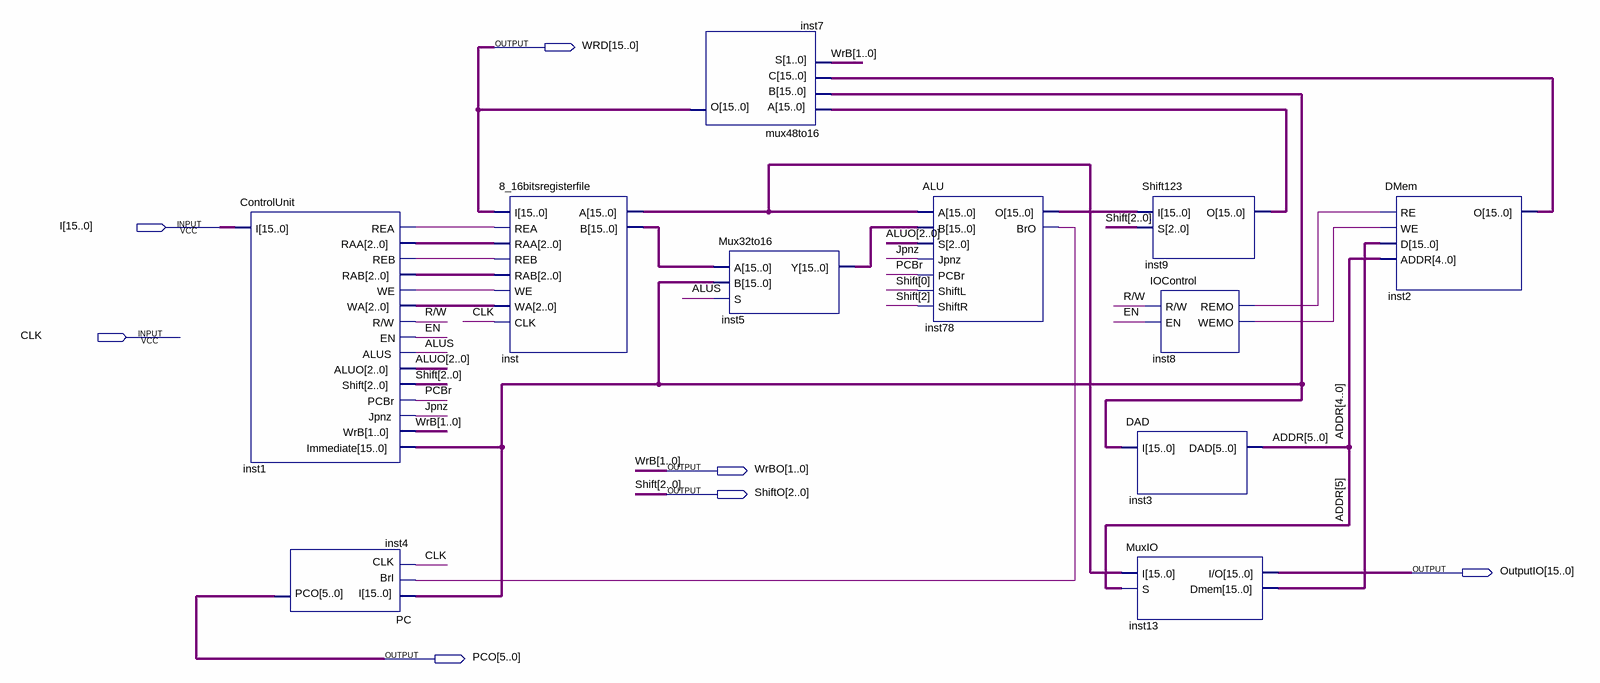
[diagram p0: schematic sheet]
// Quartus schematic test.bdf as structural Verilog: 11 symbols, 7 pins
module test (
  input  [15:0] I,
  input  CLK,
  output [15:0] WRD,
  output [1:0] WrBO,
  output [2:0] ShiftO,
  output [15:0] OutputIO,
  output [5:0] PCO
);

  wire ALUS, EN, inst1_rea, inst1_reb, inst1_we, inst8_remo, inst8_wemo, inst78_bro, Jpnz, PCBr, \R/W ;
  wire [2:0] ALUO, inst1_raa, inst1_rab, inst1_wa;
  wire [5:0] ADDR;
  wire [15:0] inst1_immediate, inst2_o, inst5_y, inst9_o, inst13_dmem, inst78_o, inst_a, inst_b;

  ControlUnit inst1 (
    .I(I), .REA(inst1_rea), .RAA(inst1_raa), .REB(inst1_reb), .RAB(inst1_rab), .WE(inst1_we), .WA(inst1_wa),
    .\R/W (\R/W ), .EN(EN), .ALUS(ALUS), .ALUO(ALUO), .Shift(ShiftO), .PCBr(PCBr), .Jpnz(Jpnz), .WrB(WrBO),
    .Immediate(inst1_immediate));
  PC inst4 (.I(inst1_immediate), .BrI(inst78_bro), .CLK(CLK), .PCO(PCO));
  \8_16bitsregisterfile  inst (
    .I(WRD), .REA(inst1_rea), .RAA(inst1_raa), .REB(inst1_reb), .RAB(inst1_rab), .WE(inst1_we),
    .WA(inst1_wa), .CLK(CLK), .A(inst_a), .B(inst_b));
  mux48to16 inst7 (.A(inst9_o), .B(inst1_immediate), .C(inst2_o), .S(WrBO), .O(WRD));
  Mux32to16 inst5 (.A(inst_b), .B(inst1_immediate), .S(ALUS), .Y(inst5_y));
  ALU inst78 (
    .A(inst_a), .B(inst5_y), .S(ALUO), .Jpnz(Jpnz), .PCBr(PCBr), .ShiftL(ShiftO[0]), .ShiftR(ShiftO[2]),
    .O(inst78_o), .BrO(inst78_bro));
  Shift123 inst9 (.I(inst78_o), .S(ShiftO), .O(inst9_o));
  IOControl inst8 (.\R/W (\R/W ), .EN(EN), .REMO(inst8_remo), .WEMO(inst8_wemo));
  DAD inst3 (.I(inst1_immediate), .DAD(ADDR));
  MuxIO inst13 (.I(inst_a), .S(ADDR[5]), .\I/O (OutputIO), .Dmem(inst13_dmem));
  DMem inst2 (.RE(inst8_remo), .WE(inst8_wemo), .D(inst13_dmem), .ADDR(ADDR[4:0]), .O(inst2_o));

  // Other names for the same wires on the sheet: Shift[2:0] = ShiftO; WrB[1:0] = WrBO
endmodule
